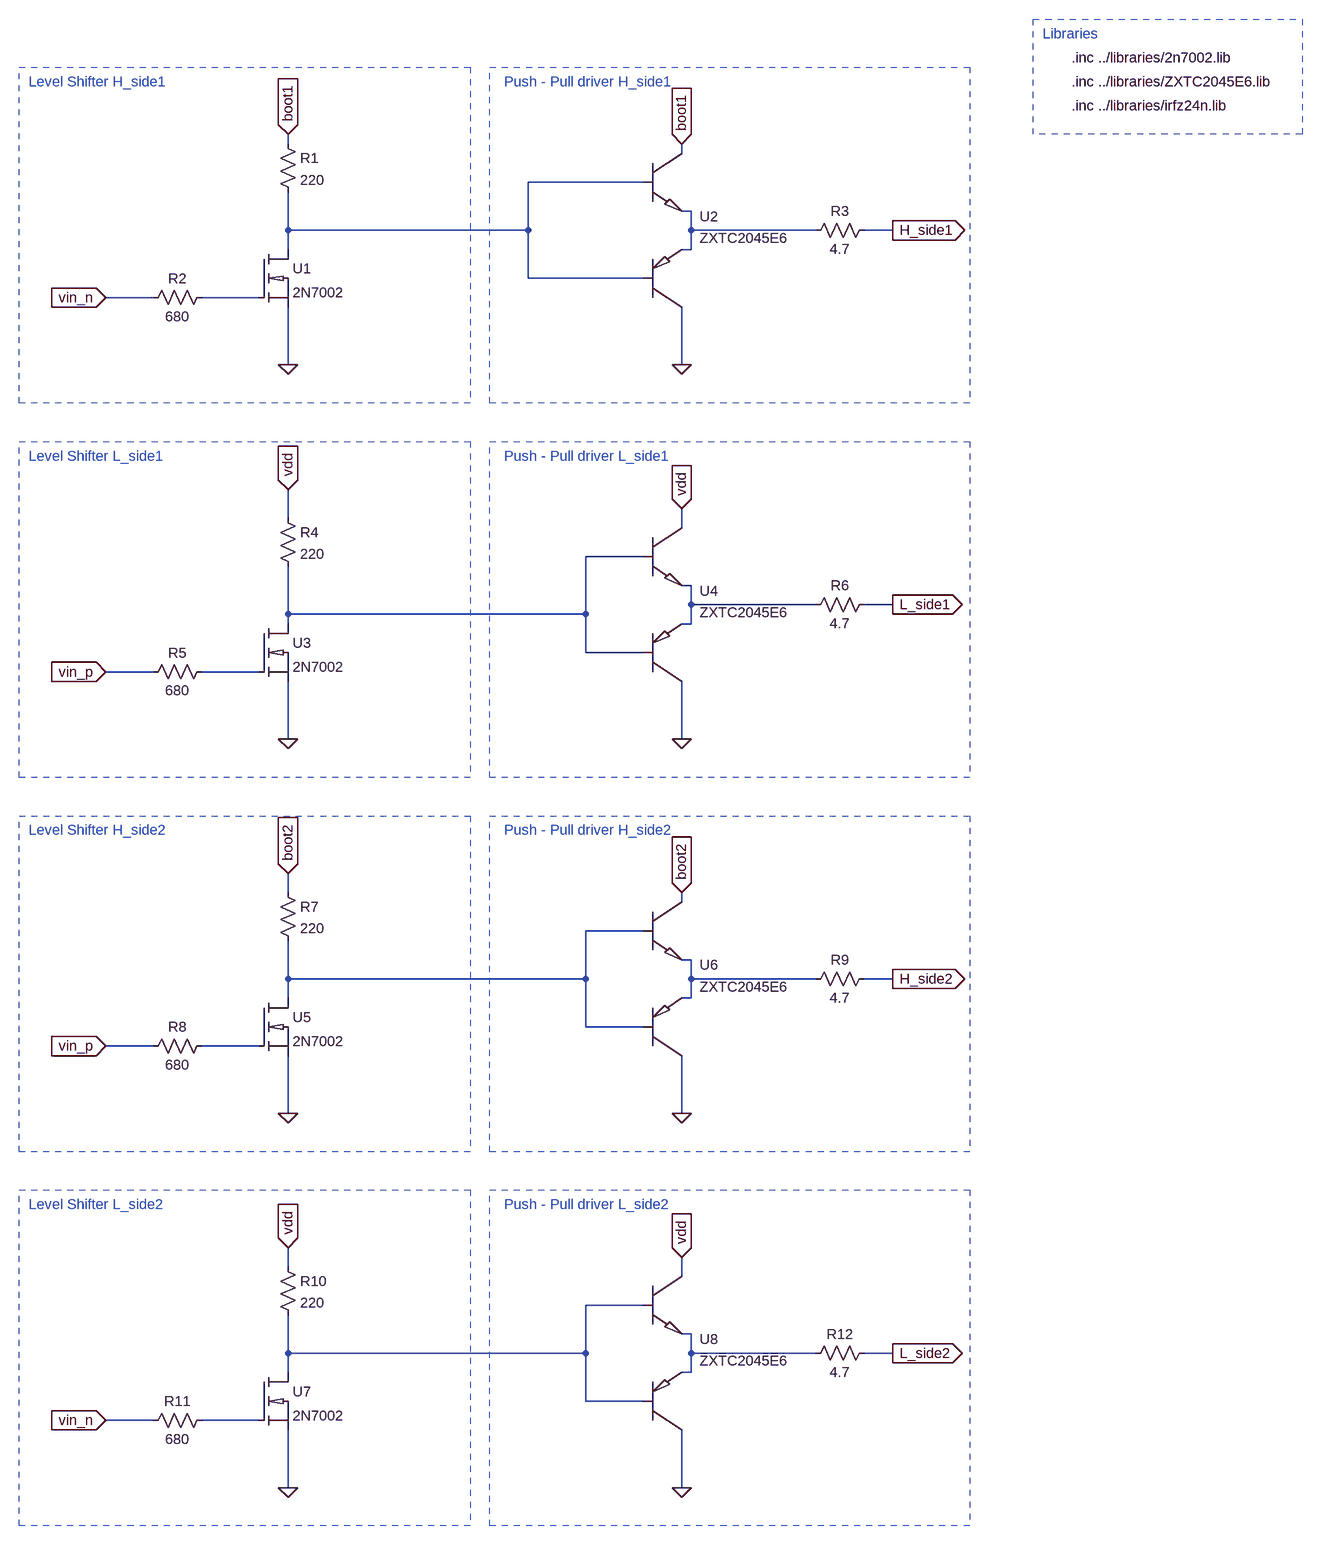
[diagram p0: schematic GateDriver_component.asc]
GateDriver_component.asc, the LTspice schematic file:
Version 4
SHEET 1 3956 2420
WIRE -384 112 -384 96
WIRE 272 128 272 112
WIRE 208 176 16 176
WIRE 288 224 272 224
WIRE -384 256 -384 192
WIRE 16 256 16 176
WIRE 16 256 -384 256
WIRE 288 256 288 224
WIRE 496 256 288 256
WIRE 624 256 576 256
WIRE -384 288 -384 256
WIRE 288 288 288 256
WIRE 288 288 272 288
WIRE 16 336 16 256
WIRE 208 336 16 336
WIRE -608 368 -688 368
WIRE -432 368 -528 368
WIRE -384 480 -384 384
WIRE 272 480 272 384
WIRE -384 736 -384 688
WIRE 272 752 272 720
WIRE 208 800 112 800
WIRE 288 848 272 848
WIRE 288 880 288 848
WIRE 496 880 288 880
WIRE 624 880 576 880
WIRE -384 896 -384 816
WIRE 112 896 112 800
WIRE 112 896 -384 896
WIRE -384 912 -384 896
WIRE 288 912 288 880
WIRE 288 912 272 912
WIRE 112 960 112 896
WIRE 208 960 112 960
WIRE -608 992 -688 992
WIRE -432 992 -528 992
WIRE -384 1104 -384 1008
WIRE 272 1104 272 1008
WIRE -384 1360 -384 1328
WIRE 272 1376 272 1360
WIRE 208 1424 112 1424
WIRE 288 1472 272 1472
WIRE -384 1504 -384 1440
WIRE 112 1504 112 1424
WIRE 112 1504 -384 1504
WIRE 288 1504 288 1472
WIRE 496 1504 288 1504
WIRE 624 1504 576 1504
WIRE -384 1536 -384 1504
WIRE 288 1536 288 1504
WIRE 288 1536 272 1536
WIRE 112 1584 112 1504
WIRE 208 1584 112 1584
WIRE -608 1616 -688 1616
WIRE -432 1616 -528 1616
WIRE -384 1728 -384 1632
WIRE 272 1728 272 1632
WIRE -384 1984 -384 1952
WIRE 272 2000 272 1968
WIRE 208 2048 112 2048
WIRE 288 2096 272 2096
WIRE -384 2128 -384 2064
WIRE 112 2128 112 2048
WIRE 112 2128 -384 2128
WIRE 288 2128 288 2096
WIRE 496 2128 288 2128
WIRE 624 2128 576 2128
WIRE -384 2160 -384 2128
WIRE 288 2160 288 2128
WIRE 288 2160 272 2160
WIRE 112 2208 112 2128
WIRE 208 2208 112 2208
WIRE -608 2240 -688 2240
WIRE -432 2240 -528 2240
WIRE -384 2352 -384 2256
WIRE 272 2352 272 2256
FLAG -384 480 0
FLAG -688 368 vin_n
IOPIN -688 368 In
FLAG -384 96 boot1
IOPIN -384 96 In
FLAG 272 480 0
FLAG 272 112 boot1
IOPIN 272 112 In
FLAG 624 256 H_side1
IOPIN 624 256 Out
FLAG -384 1104 0
FLAG -688 992 vin_p
IOPIN -688 992 In
FLAG -384 688 vdd
IOPIN -384 688 In
FLAG 272 1104 0
FLAG 272 720 vdd
IOPIN 272 720 In
FLAG 624 880 L_side1
IOPIN 624 880 Out
FLAG -384 1728 0
FLAG -688 1616 vin_p
IOPIN -688 1616 In
FLAG -384 1328 boot2
IOPIN -384 1328 In
FLAG 272 1728 0
FLAG 272 1360 boot2
IOPIN 272 1360 In
FLAG 624 1504 H_side2
IOPIN 624 1504 Out
FLAG -384 2352 0
FLAG -688 2240 vin_n
IOPIN -688 2240 In
FLAG -384 1952 vdd
IOPIN -384 1952 In
FLAG 272 2352 0
FLAG 272 1968 vdd
IOPIN 272 1968 In
FLAG 624 2128 L_side2
IOPIN 624 2128 Out
SYMBOL 2n7002 -432 288 R0
SYMATTR InstName U1
SYMBOL res -400 96 R0
SYMATTR InstName R1
SYMATTR Value 220
SYMBOL res -512 352 R90
WINDOW 0 0 56 VBottom 2
WINDOW 3 32 56 VTop 2
SYMATTR InstName R2
SYMATTR Value 680
SYMBOL ZXTC2045E6 208 144 R0
SYMATTR InstName U2
SYMBOL res 592 240 R90
WINDOW 0 0 56 VBottom 2
WINDOW 3 32 56 VTop 2
SYMATTR InstName R3
SYMATTR Value 4.7
SYMBOL 2n7002 -432 912 R0
SYMATTR InstName U3
SYMBOL res -400 720 R0
SYMATTR InstName R4
SYMATTR Value 220
SYMBOL res -512 976 R90
WINDOW 0 0 56 VBottom 2
WINDOW 3 32 56 VTop 2
SYMATTR InstName R5
SYMATTR Value 680
SYMBOL ZXTC2045E6 208 768 R0
SYMATTR InstName U4
SYMBOL res 592 864 R90
WINDOW 0 0 56 VBottom 2
WINDOW 3 32 56 VTop 2
SYMATTR InstName R6
SYMATTR Value 4.7
SYMBOL 2n7002 -432 1536 R0
SYMATTR InstName U5
SYMBOL res -400 1344 R0
SYMATTR InstName R7
SYMATTR Value 220
SYMBOL res -512 1600 R90
WINDOW 0 0 56 VBottom 2
WINDOW 3 32 56 VTop 2
SYMATTR InstName R8
SYMATTR Value 680
SYMBOL ZXTC2045E6 208 1392 R0
SYMATTR InstName U6
SYMBOL res 592 1488 R90
WINDOW 0 0 56 VBottom 2
WINDOW 3 32 56 VTop 2
SYMATTR InstName R9
SYMATTR Value 4.7
SYMBOL 2n7002 -432 2160 R0
SYMATTR InstName U7
SYMBOL res -400 1968 R0
SYMATTR InstName R10
SYMATTR Value 220
SYMBOL res -512 2224 R90
WINDOW 0 0 56 VBottom 2
WINDOW 3 32 56 VTop 2
SYMATTR InstName R11
SYMATTR Value 680
SYMBOL ZXTC2045E6 208 2016 R0
SYMATTR InstName U8
SYMBOL res 592 2112 R90
WINDOW 0 0 56 VBottom 2
WINDOW 3 32 56 VTop 2
SYMATTR InstName R12
SYMATTR Value 4.7
TEXT 2352 -32 Left 2 !.inc ../libraries/2n7002.lib
TEXT -816 8 Left 2 ;Level Shifter H_side1
TEXT -24 8 Left 2 ;Push - Pull driver H_side1
TEXT -816 632 Left 2 ;Level Shifter L_side1
TEXT -24 632 Left 2 ;Push - Pull driver L_side1
TEXT 2352 8 Left 2 !.inc ../libraries/ZXTC2045E6.lib
TEXT -816 1256 Left 2 ;Level Shifter H_side2
TEXT -24 1256 Left 2 ;Push - Pull driver H_side2
TEXT -816 1880 Left 2 ;Level Shifter L_side2
TEXT -24 1880 Left 2 ;Push - Pull driver L_side2
TEXT 2352 48 Left 2 !.inc ../libraries/irfz24n.lib
TEXT 2304 -72 Left 2 ;Libraries
RECTANGLE Normal -80 544 -832 -16 2
RECTANGLE Normal 752 544 -48 -16 2
RECTANGLE Normal -80 1168 -832 608 2
RECTANGLE Normal 752 1168 -48 608 2
RECTANGLE Normal -80 1792 -832 1232 2
RECTANGLE Normal 752 1792 -48 1232 2
RECTANGLE Normal -80 2416 -832 1856 2
RECTANGLE Normal 752 2416 -48 1856 2
RECTANGLE Normal 2736 96 2288 -96 2

The netlist it stands for:
* GateDriver_component.asc
XU1 N001 N003 0 2N7002  ; pins D G S
R1 boot1 N001 220
R2 N003 vin_n 680
XU2 boot1 N001 0 N002 N001 N002 ZXTC2045E6  ; pins C B C1 E1 B1 E
R3 H_side1 N002 4.7
XU3 N004 N006 0 2N7002  ; pins D G S
R4 vdd N004 220
R5 N006 vin_p 680
XU4 vdd N004 0 N005 N004 N005 ZXTC2045E6  ; pins C B C1 E1 B1 E
R6 L_side1 N005 4.7
XU5 N007 N009 0 2N7002  ; pins D G S
R7 boot2 N007 220
R8 N009 vin_p 680
XU6 boot2 N007 0 N008 N007 N008 ZXTC2045E6  ; pins C B C1 E1 B1 E
R9 H_side2 N008 4.7
XU7 N010 N012 0 2N7002  ; pins D G S
R10 vdd N010 220
R11 N012 vin_n 680
XU8 vdd N010 0 N011 N010 N011 ZXTC2045E6  ; pins C B C1 E1 B1 E
R12 L_side2 N011 4.7
.inc ../libraries/2n7002.lib
* Level Shifter H_side1
* Push - Pull driver H_side1
* Level Shifter L_side1
* Push - Pull driver L_side1
.inc ../libraries/ZXTC2045E6.lib
* Level Shifter H_side2
* Push - Pull driver H_side2
* Level Shifter L_side2
* Push - Pull driver L_side2
.inc ../libraries/irfz24n.lib
* Libraries
.backanno
.end